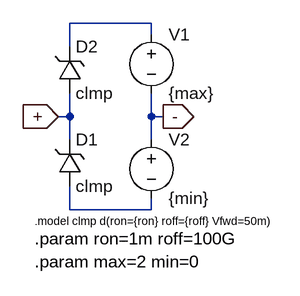
[diagram p0: schematic vminmax_clamp.asc]
vminmax_clamp.asc, the LTspice schematic file:
Version 4
SHEET 1 880 680
WIRE 80 -80 -32 -80
WIRE 80 -64 80 -80
WIRE -32 -48 -32 -80
WIRE -32 48 -32 16
WIRE -32 48 -48 48
WIRE 80 48 80 16
WIRE 96 48 80 48
WIRE -32 80 -32 48
WIRE 80 80 80 48
WIRE -32 176 -32 144
WIRE 80 176 80 160
WIRE 80 176 -32 176
FLAG -48 48 +
IOPIN -48 48 In
FLAG 96 48 -
IOPIN 96 48 Out
SYMBOL zener -48 144 M180
WINDOW 0 24 64 Left 2
WINDOW 3 24 0 Left 2
SYMATTR InstName D1
SYMATTR Value clmp
SYMBOL zener -48 16 M180
WINDOW 0 24 64 Left 2
WINDOW 3 24 0 Left 2
SYMATTR InstName D2
SYMATTR Value clmp
SYMBOL voltage 80 -80 R0
SYMATTR InstName V1
SYMATTR Value {max}
SYMBOL voltage 80 64 R0
SYMATTR InstName V2
SYMATTR Value {min}
TEXT -80 192 Left 1 !.model clmp d(ron={ron} roff={roff} Vfwd=50m)
TEXT -80 216 Left 2 !.param ron=1m roff=100G\n.param max=2 min=0

The netlist it stands for:
* vminmax_clamp.asc
D1 N002 + clmp
D2 + N001 clmp
V1 N001 - {max}
V2 - N002 {min}
.model D D
.lib standard.dio
.model clmp d(ron={ron} roff={roff} Vfwd=50m)
.param ron=1m roff=100G
.param max=2 min=0
.backanno
.end